# Altium schematic sheet Sensors.SchDoc
size A; SheetNumber: 3; SheetTotal: 3
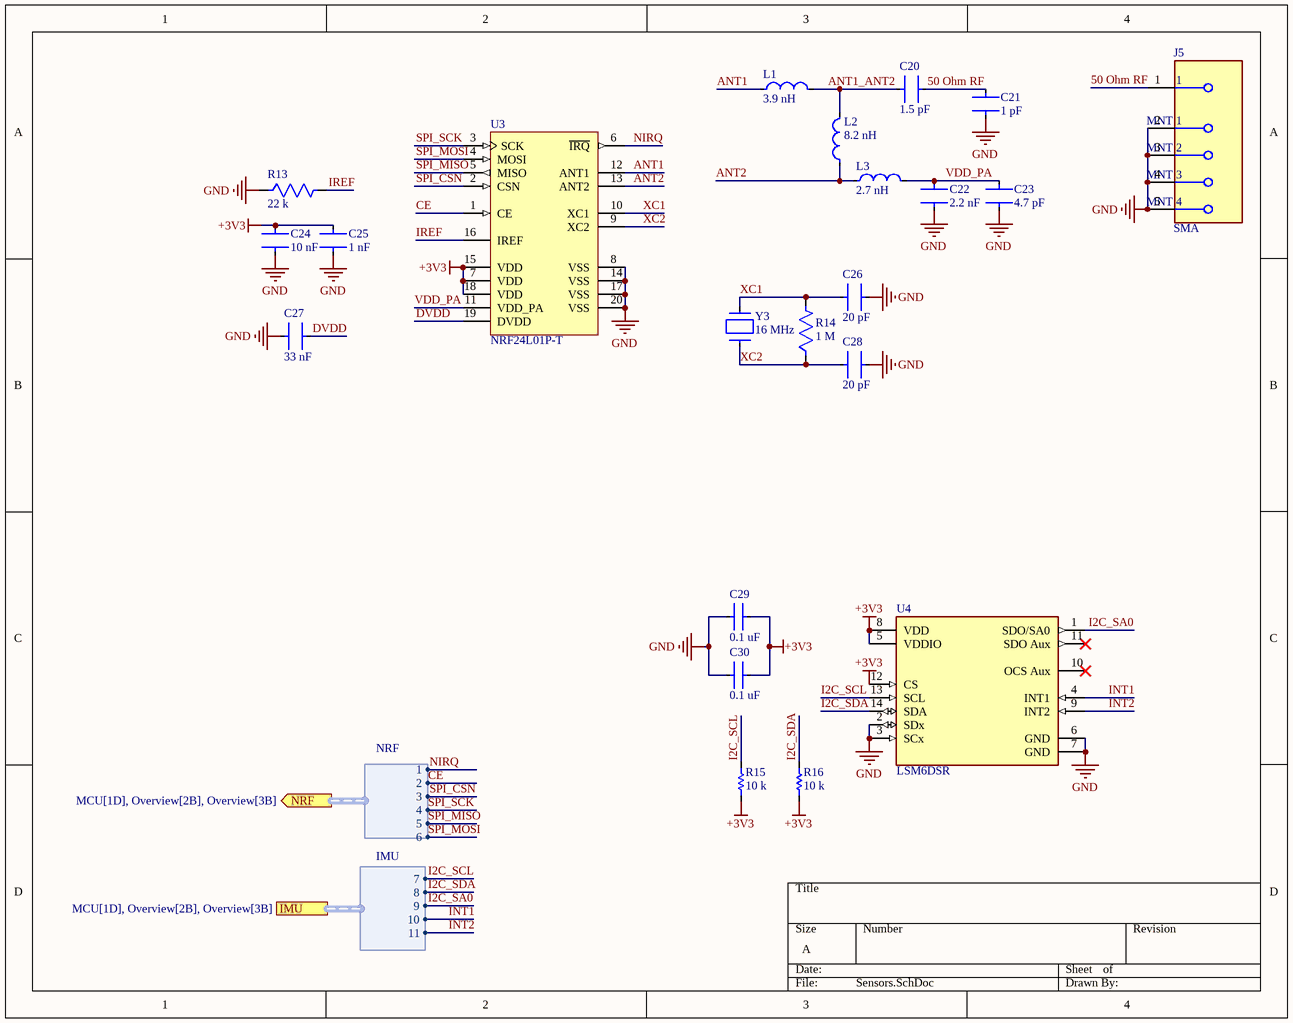
[diagram p0: Sensors.SchDoc]

## Parts
C20  1.5 pF  [1_5pF_0402_Capacitor]
C21  1 pF  [1pF_0402_Capacitor]
C22  2.2 nF  [2_2nF_0402_Capacitor]
C23  4.7 pF  [4_7pF_0402_Capacitor]
C24  10 nF  [10nF_0402_Capacitor]
C25  1 nF  [1nF_0402_Capacitor]
C26  20 pF  [20pF_0402_Capacitor]
C27  33 nF  [33nF_0402_Capacitor]
C28  20 pF  [20pF_0402_Capacitor]
C29  0.1 uF  [0_1uF_0603_Capacitor]
C30  0.1 uF  [0_1uF_0603_Capacitor]
J5  SMA  [SMA_Connector]
L1  3.9 nH  [3_9nH_0402_Inductor]
L2  8.2 nH  [8_2nH_0402_Inductor]
L3  2.7 nH  [2_7nH_0402_Inductor]
R13  22 k  [22k_0402_Resistor]
R14  1 M  [1M_0402_Resistor]
R15  10 k  [10k_0603_Resistor]
R16  10 k  [10k_0603_Resistor]
U3  NRF24L01P-T  [nRF_Transceiver]
U4  LSM6DSR  [IMU]
Y3  16 MHz  [16MHz_Oscillator]

## Ports
IMU (harness IMU, see MCU[1D], Overview[2B], Overview[3B]), NRF (out, harness NRF, see MCU[1D], Overview[2B], Overview[3B])

## Harnesses
NRF: 1, 2, 3, 4, 5, 6
IMU: 7, 8, 9, 10, 11

## Nets
+3V3: C24.1 C25.1 C29.1 C30.1 R15.1 R16.1 U3.7(VDD) U3.15(VDD) U3.18(VDD) U4.5(VDDIO) U4.8(VDD) U4.12(CS)
GND: C21.2 C22.2 C23.2 C24.2 C25.2 C26.1 C27.2 C28.1 C29.2 C30.2 J5.2(MNT_1) J5.3(MNT_2) J5.4(MNT_3) J5.5(MNT_4) R13.1 U3.8(VSS) U3.14(VSS) U3.17(VSS) U3.20(VSS) U4.2(SDx) U4.3(SCx) U4.6(GND) U4.7(GND)
50 Ohm RF: C20.1 C21.1 J5.1
ANT1: L1.1 U3.12(ANT1)
ANT1_ANT2: C20.2 L1.2 L2.2
ANT2: L2.1 L3.1 U3.13(ANT2)
CE: U3.1(CE) ; port NRF.2
DVDD: C27.1 U3.19(DVDD)
I2C_SA0: U4.1(SDO/SA0) ; port IMU.9
I2C_SCL: R15.2 U4.13(SCL) ; port IMU.7
I2C_SDA: R16.2 U4.14(SDA) ; port IMU.8
INT1: U4.4(INT1) ; port IMU.10
INT2: U4.9(INT2) ; port IMU.11
IREF: R13.2 U3.16(IREF)
NIRQ: U3.6(~{IRQ}) ; port NRF.1
SPI_CSN: U3.2(CSN) ; port NRF.3
SPI_MISO: U3.5(MISO) ; port NRF.5
SPI_MOSI: U3.4(MOSI) ; port NRF.6
SPI_SCK: U3.3(SCK) ; port NRF.4
VDD_PA: C22.1 C23.1 L3.2 U3.11(VDD_PA)
XC1: C26.2 R14.2 U3.10(XC1) Y3.2
XC2: C28.2 R14.1 U3.9(XC2) Y3.1

Not connected (* = marked no-connect by the designer): U4 10(OCS_Aux)* 11(SDO_Aux)*

## Library data of the parts
C20 = 1_5pF_0402_Capacitor: Ceramic Capacitor, Multilayer, Ceramic, 50V, 6.67% +Tol, 6.67% -Tol, C0G, 30ppm/Cel TC, 0.0000015uF, Surface Mount, 0402, GJM1555C1H1R5BB01D; Manufacturer: Murata; Value: 1.5pF; Multilayer: Yes; Supplier: Digikey; Supplier Part Number: 490-8087-1-ND; Manufacturer Part Number: GJM1555C1H1R5BB01D; RoHS: Yes; Category: Ceramic Capacitors; Stock: 82715; Pricing: 1=0.14, 10=0.095, 50=0.057, 100=0.0449, 500=0.03314, 1000=0.02744, 2500=0.02554, 5000=0.02336 (USD); Mounting Technology: Surface Mount; Pins: 2; Dielectric Material: Ceramic; Package Shape: Rectangular; Case/Package: 0402; Terminal Finish: Nickel; Min Operating Temperature: -55°C; Max Operating Temperature: 125°C; JESD-609 Code: e3; Capacitor Type: Ceramic; Tolerance  (fill in as +-): 6.67%; Package Style: SMTMeter; Packaging: Tape and Reel; Tolerance (fill in as +-): 6.67%; Rated DC Voltage (URdc): 50V; Temperature Characteristics Code: C0G; Termination: Wraparound; Length: 1mm; Width: 0.5mm; Height: 0.5mm; Reach SVHC Compliant: Yes; RoHS Compliant: Yes; ComponentLink1URL: https://datasheet.ciiva.com:443/pdfs/VipMasterIC/IC/MURE/MURE-S-A0008911298/MURE-S-A0008911391-1.pdf?src-supplier=IHS+Markit; ComponentLink1Description: https://datasheet.ciiva.com:443/pdfs/VipMasterIC/IC/MURE/MURE-S-A0008911298/MURE-S-A0008911391-1.pdf?src-supplier=IHS+Markit; ComponentLink2URL: https://datasheet.ciiva.com/8030/1700191-8030107.pdf?src-supplier=Element14; ComponentLink2Description: https://datasheet.ciiva.com/8030/1700191-8030107.pdf?src-supplier=Element14; ComponentLink3URL: https://datasheet.ciiva.com/26843/getdatasheetpartid-698463-26843693.pdf?src-supplier=Verical; ComponentLink3Description: https://datasheet.ciiva.com/26843/getdatasheetpartid-698463-26843693.pdf?src-supplier=Verical; ComponentLink4URL: https://datasheet.ciiva.com/29542/partnumbering-e-01-29542725.pdf?src-supplier=Digikey; ComponentLink4Description: https://datasheet.ciiva.com/29542/partnumbering-e-01-29542725.pdf?src-supplier=Digikey; ComponentLink5URL: https://datasheet.ciiva.com/29542/partnumbering-e-01-29542726.pdf?src-supplier=Digikey; ComponentLink5Description: https://datasheet.ciiva.com/29542/partnumbering-e-01-29542726.pdf?src-supplier=Digikey; ComponentLink6URL: https://datasheet.ciiva.com/16440/l0005e-16440473.pdf?src-supplier=Future+Electronics; ComponentLink6Description: https://datasheet.ciiva.com/16440/l0005e-16440473.pdf?src-supplier=Future+Electronics; Supplier 1: Digikey; Supplier Part Number 1: 490-8087-1-ND
C21 = 1pF_0402_Capacitor: Ceramic Capacitor, Multilayer, Ceramic, 50V, 5% +Tol, 5% -Tol, C0G, 30ppm/Cel TC, 0.000001uF, Surface Mount, 0402, GJM1555C1H1R0WB01D; Manufacturer: Murata; Value: 1pF; Multilayer: Yes; Supplier: Digikey; Supplier Part Number: 490-11193-1-ND; Manufacturer Part Number: GJM1555C1H1R0WB01D; RoHS: Yes; Category: Ceramic Capacitors; Stock: 48946; Pricing: 1=0.18, 10=0.122, 50=0.073, 100=0.0574, 500=0.04242, 1000=0.03511, 2500=0.03268, 5000=0.0299 (USD); Mounting Technology: Surface Mount; Pins: 2; Dielectric Material: Ceramic; Package Shape: Rectangular; Case/Package: 0402; Terminal Finish: Nickel; Min Operating Temperature: -55°C; Max Operating Temperature: 125°C; JESD-609 Code: e3; Capacitor Type: Ceramic; Tolerance  (fill in as +-): 5%; Package Style: SMTMeter; Packaging: Tape and Reel; Tolerance (fill in as +-): 5%; Rated DC Voltage (URdc): 50V; Temperature Characteristics Code: C0G; Termination: Wraparound; Length: 1mm; Width: 0.5mm; Height: 0.5mm; Reach SVHC Compliant: Yes; RoHS Compliant: Yes; ComponentLink1URL: https://datasheet.ciiva.com:443/pdfs/VipMasterIC/IC/MURE/MURE-S-A0004378008/MURE-S-A0004383032-1.pdf?src-supplier=IHS+Markit; ComponentLink1Description: https://datasheet.ciiva.com:443/pdfs/VipMasterIC/IC/MURE/MURE-S-A0004378008/MURE-S-A0004383032-1.pdf?src-supplier=IHS+Markit; ComponentLink2URL: https://datasheet.ciiva.com/11616/product-11616304.pdf?src-supplier=Avnet; ComponentLink2Description: https://datasheet.ciiva.com/11616/product-11616304.pdf?src-supplier=Avnet; Supplier 1: Digikey; Supplier Part Number 1: 490-11193-1-ND
C22 = 2_2nF_0402_Capacitor: Ceramic Capacitor, Multilayer, Ceramic, 50V, 10% +Tol, 10% -Tol, X7R, 15% TC, 0.0022uF, Surface Mount, 0402, CC0402KRX7R9BB222; Manufacturer: Yageo; Value: 2.2nF; Multilayer: Yes; Supplier: Digikey; Supplier Part Number: 311-1037-1-ND; Manufacturer Part Number: CC0402KRX7R9BB222; RoHS: Yes; Category: Ceramic Capacitors; Stock: 310458; Pricing: 1=0.1, 10=0.017, 50=0.0098, 100=0.0076, 500=0.00572, 1000=0.0045, 2500=0.00409, 5000=0.00376 (USD); Mounting Technology: Surface Mount; Pins: 2; Dielectric Material: Ceramic; Package Shape: Rectangular; Case/Package: 0402; Terminal Finish: Nickel; Min Operating Temperature: -55°C; Max Operating Temperature: 125°C; JESD-609 Code: e3; Capacitor Type: Ceramic; Tolerance  (fill in as +-): 10%; Package Style: SMTMeter; Packaging: Tape and Reel; Tolerance (fill in as +-): 10%; Rated DC Voltage (URdc): 50V; Temperature Characteristics Code: X7R; Termination: Wraparound; Length: 1mm; Width: 0.5mm; Height: 0.5mm; Reach SVHC Compliant: Yes; RoHS Compliant: Yes; ComponentLink1URL: https://datasheet.ciiva.com:443/pdfs/VipMasterIC/IC/YAGO/YAGO-S-A0003557223/YAGO-S-A0003557223-1.pdf?src-supplier=IHS+Markit; ComponentLink1Description: https://datasheet.ciiva.com:443/pdfs/VipMasterIC/IC/YAGO/YAGO-S-A0003557223/YAGO-S-A0003557223-1.pdf?src-supplier=IHS+Markit; ComponentLink2URL: https://datasheet.ciiva.com/26862/getdatasheetpartid-315909-26862649.pdf?src-supplier=Verical; ComponentLink2Description: https://datasheet.ciiva.com/26862/getdatasheetpartid-315909-26862649.pdf?src-supplier=Verical; ComponentLink3URL: https://datasheet.ciiva.com/155/mlccorderingcode-155866.pdf?src-supplier=Digikey; ComponentLink3Description: https://datasheet.ciiva.com/155/mlccorderingcode-155866.pdf?src-supplier=Digikey; ComponentLink4URL: https://datasheet.ciiva.com/155/mlccorderingcode-155867.pdf?src-supplier=Digikey; ComponentLink4Description: https://datasheet.ciiva.com/155/mlccorderingcode-155867.pdf?src-supplier=Digikey; ComponentLink5URL: https://datasheet.ciiva.com/155/mlccorderingcode-155868.pdf?src-supplier=Digikey; ComponentLink5Description: https://datasheet.ciiva.com/155/mlccorderingcode-155868.pdf?src-supplier=Digikey; ComponentLink6URL: https://datasheet.ciiva.com/11464/upy-gphc-x7r-6-3v-to-50v-8-11464903.pdf?src-supplier=Avnet; ComponentLink6Description: https://datasheet.ciiva.com/11464/upy-gphc-x7r-6-3v-to-50v-8-11464903.pdf?src-supplier=Avnet; ComponentLink7URL: https://datasheet.ciiva.com/8033/1489800-8033625.pdf?src-supplier=Element14; ComponentLink7Description: https://datasheet.ciiva.com/8033/1489800-8033625.pdf?src-supplier=Element14; ComponentLink8URL: https://datasheet.ciiva.com/8033/70765-8033626.pdf?src-supplier=Element14; ComponentLink8Description: https://datasheet.ciiva.com/8033/70765-8033626.pdf?src-supplier=Element14; ComponentLink9URL: https://datasheet.ciiva.com/8033/1489800-8033627.pdf?src-supplier=Element14; ComponentLink9Description: https://datasheet.ciiva.com/8033/1489800-8033627.pdf?src-supplier=Element14; Supplier 1: Digikey; Supplier Part Number 1: 311-1037-1-ND
C23 = 4_7pF_0402_Capacitor: Ceramic Capacitor, Multilayer, Ceramic, 50V, 5.32% +Tol, 5.32% -Tol, C0G, 30ppm/Cel TC, 0.0000047uF, Surface Mount, 0402, GJM1555C1H4R7CB01D; Manufacturer: Murata; Value: 4.7pF; Multilayer: Yes; Supplier: Digikey; Supplier Part Number: 490-3100-1-ND; Manufacturer Part Number: GJM1555C1H4R7CB01D; RoHS: Yes; Category: Ceramic Capacitors; Stock: 754324; Pricing: 1=0.1, 10=0.047, 50=0.0268, 100=0.0208, 500=0.01566, 1000=0.0123, 2500=0.01118, 5000=0.01029 (USD); Mounting Technology: Surface Mount; Pins: 2; Dielectric Material: Ceramic; Package Shape: Rectangular; Case/Package: 0402; Terminal Finish: Nickel; Min Operating Temperature: -55°C; Max Operating Temperature: 125°C; JESD-609 Code: e3; Capacitor Type: Ceramic; Tolerance  (fill in as +-): 5.32%; Package Style: SMTMeter; Packaging: Tape and Reel; Tolerance (fill in as +-): 5.32%; Rated DC Voltage (URdc): 50V; Temperature Characteristics Code: C0G; Termination: Wraparound; Length: 1mm; Width: 0.5mm; Height: 0.5mm; Reach SVHC Compliant: Yes; RoHS Compliant: Yes; ComponentLink1URL: https://datasheet.ciiva.com:443/pdfs/VipMasterIC/IC/MURE/MURE-S-A0008911298/MURE-S-A0008911422-1.pdf?src-supplier=IHS+Markit; ComponentLink1Description: https://datasheet.ciiva.com:443/pdfs/VipMasterIC/IC/MURE/MURE-S-A0008911298/MURE-S-A0008911422-1.pdf?src-supplier=IHS+Markit; ComponentLink2URL: https://datasheet.ciiva.com/11789/0900766b80ef921d-11789169.pdf?src-supplier=Rs; ComponentLink2Description: https://datasheet.ciiva.com/11789/0900766b80ef921d-11789169.pdf?src-supplier=Rs; ComponentLink3URL: https://datasheet.ciiva.com/11613/product-11613025.pdf?src-supplier=Avnet; ComponentLink3Description: https://datasheet.ciiva.com/11613/product-11613025.pdf?src-supplier=Avnet; ComponentLink4URL: https://datasheet.ciiva.com/18183/getdatasheetpartid-178941-18183849.pdf?src-supplier=Verical; ComponentLink4Description: https://datasheet.ciiva.com/18183/getdatasheetpartid-178941-18183849.pdf?src-supplier=Verical; ComponentLink5URL: https://datasheet.ciiva.com/8030/1700177-8030123.pdf?src-supplier=Element14; ComponentLink5Description: https://datasheet.ciiva.com/8030/1700177-8030123.pdf?src-supplier=Element14; ComponentLink6URL: https://datasheet.ciiva.com/5694/1700177-5694989.pdf?src-supplier=Farnell; ComponentLink6Description: https://datasheet.ciiva.com/5694/1700177-5694989.pdf?src-supplier=Farnell; ComponentLink7URL: https://datasheet.ciiva.com/133/partnumbering-e-01-133147.pdf?src-supplier=Digikey; ComponentLink7Description: https://datasheet.ciiva.com/133/partnumbering-e-01-133147.pdf?src-supplier=Digikey; ComponentLink8URL: https://datasheet.ciiva.com/133/partnumbering-e-01-133148.pdf?src-supplier=Digikey; ComponentLink8Description: https://datasheet.ciiva.com/133/partnumbering-e-01-133148.pdf?src-supplier=Digikey; ComponentLink9URL: https://datasheet.ciiva.com/133/partnumbering-e-01-133149.pdf?src-supplier=Digikey; ComponentLink9Description: https://datasheet.ciiva.com/133/partnumbering-e-01-133149.pdf?src-supplier=Digikey; ComponentLink10URL: https://datasheet.ciiva.com/16440/l0005e-16440462.pdf?src-supplier=Future+Electronics; ComponentLink10Description: https://datasheet.ciiva.com/16440/l0005e-16440462.pdf?src-supplier=Future+Electronics; Supplier 1: Digikey; Supplier Part Number 1: 490-3100-1-ND
C24 = 10nF_0402_Capacitor: Ceramic Capacitor, Multilayer, Ceramic, 16V, 10% +Tol, 10% -Tol, X7R, 15% TC, 0.01uF, Surface Mount, 0402, CC0402KRX7R7BB103; Manufacturer: Yageo; Value: 10nF; Multilayer: Yes; Supplier: Digikey; Supplier Part Number: 311-1042-1-ND; Manufacturer Part Number: CC0402KRX7R7BB103; RoHS: Yes; Category: Ceramic Capacitors; Stock: 1013311; Pricing: 1=0.1, 10=0.015, 50=0.0088, 100=0.0068, 500=0.0051, 1000=0.004, 2500=0.00364, 5000=0.00335 (USD); Mounting Technology: Surface Mount; Pins: 2; Dielectric Material: Ceramic; Package Shape: Rectangular; Case/Package: 0402; Terminal Finish: Nickel; Min Operating Temperature: -55°C; Max Operating Temperature: 125°C; JESD-609 Code: e3; Capacitor Type: Ceramic; Tolerance  (fill in as +-): 10%; Package Style: SMTMeter; Packaging: Tape and Reel; Tolerance (fill in as +-): 10%; Rated DC Voltage (URdc): 16V; Temperature Characteristics Code: X7R; Termination: Wraparound; Length: 1mm; Width: 0.5mm; Height: 0.5mm; Reach SVHC Compliant: Yes; RoHS Compliant: Yes; ComponentLink1URL: https://datasheet.ciiva.com:443/pdfs/VipMasterIC/IC/YAGO/YAGO-S-A0003557223/YAGO-S-A0003557223-1.pdf?src-supplier=IHS+Markit; ComponentLink1Description: https://datasheet.ciiva.com:443/pdfs/VipMasterIC/IC/YAGO/YAGO-S-A0003557223/YAGO-S-A0003557223-1.pdf?src-supplier=IHS+Markit; ComponentLink2URL: https://datasheet.ciiva.com/143/mlccorderingcode-143950.pdf?src-supplier=Digikey; ComponentLink2Description: https://datasheet.ciiva.com/143/mlccorderingcode-143950.pdf?src-supplier=Digikey; ComponentLink3URL: https://datasheet.ciiva.com/143/mlccorderingcode-143951.pdf?src-supplier=Digikey; ComponentLink3Description: https://datasheet.ciiva.com/143/mlccorderingcode-143951.pdf?src-supplier=Digikey; ComponentLink4URL: https://datasheet.ciiva.com/143/upy-gphc-x7r-6-3v-to-50v-8-143952.pdf?src-supplier=Digikey; ComponentLink4Description: https://datasheet.ciiva.com/143/upy-gphc-x7r-6-3v-to-50v-8-143952.pdf?src-supplier=Digikey; ComponentLink5URL: https://datasheet.ciiva.com/28450/1489800-28450330.pdf?src-supplier=Element14; ComponentLink5Description: https://datasheet.ciiva.com/28450/1489800-28450330.pdf?src-supplier=Element14; ComponentLink6URL: https://datasheet.ciiva.com/8033/70765-8033655.pdf?src-supplier=Element14; ComponentLink6Description: https://datasheet.ciiva.com/8033/70765-8033655.pdf?src-supplier=Element14; ComponentLink7URL: https://datasheet.ciiva.com/8033/1489800-8033658.pdf?src-supplier=Element14; ComponentLink7Description: https://datasheet.ciiva.com/8033/1489800-8033658.pdf?src-supplier=Element14; ComponentLink8URL: https://datasheet.ciiva.com/8033/1489800-8033659.pdf?src-supplier=Element14; ComponentLink8Description: https://datasheet.ciiva.com/8033/1489800-8033659.pdf?src-supplier=Element14; ComponentLink9URL: https://datasheet.ciiva.com/5425/upy-gp-np0-16v-to-50v-8-3714-5425438.pdf?src-supplier=Mouser; ComponentLink9Description: https://datasheet.ciiva.com/5425/upy-gp-np0-16v-to-50v-8-3714-5425438.pdf?src-supplier=Mouser; ComponentLink10URL: https://datasheet.ciiva.com/7978/1489800-7978109.pdf?src-supplier=Element14; ComponentLink10Description: https://datasheet.ciiva.com/7978/1489800-7978109.pdf?src-supplier=Element14; Supplier 1: Digikey; Supplier Part Number 1: 311-1042-1-ND
C25 = 1nF_0402_Capacitor: Ceramic Capacitor, Multilayer, Ceramic, 50V, 5% +Tol, 5% -Tol, C0G, 30ppm/Cel TC, 0.001uF, Surface Mount, 0402, GRM1555C1H102JA01D; Manufacturer: Murata; Value: 1nF; Multilayer: Yes; Supplier: Digikey; Supplier Part Number: 490-3244-1-ND; Manufacturer Part Number: GRM1555C1H102JA01D; RoHS: Yes; Category: Ceramic Capacitors; Stock: 19426344; Pricing: 1=0.1, 10=0.025, 50=0.0146, 100=0.0113, 500=0.00848, 1000=0.00666, 2500=0.00605, 5000=0.00557 (USD); Mounting Technology: Surface Mount; Pins: 2; Dielectric Material: Ceramic; Package Shape: Rectangular; Case/Package: 0402; Terminal Finish: Nickel; Min Operating Temperature: -55°C; Max Operating Temperature: 125°C; Capacitor Type: Ceramic; JESD-609 Code: e3; Tolerance  (fill in as +-): 5%; Package Style: SMTMeter; Packaging: Tape and Reel; Tolerance (fill in as +-): 5%; Rated DC Voltage (URdc): 50V; Temperature Characteristics Code: C0G; Termination: Wraparound; Length: 1mm; Width: 0.5mm; Height: 0.5mm; Reach SVHC Compliant: Yes; RoHS Compliant: Yes; ComponentLink1URL: https://psearch.en.murata.com:443/capacitor/product/GRM1555C1H102JA01%23.pdf?src-supplier=IHS+Markit; ComponentLink1Description: https://psearch.en.murata.com:443/capacitor/product/GRM1555C1H102JA01%23.pdf?src-supplier=IHS+Markit; ComponentLink2URL: https://datasheet.ciiva.com/11786/0900766b807a1cab-11786727.pdf?src-supplier=Rs; ComponentLink2Description: https://datasheet.ciiva.com/11786/0900766b807a1cab-11786727.pdf?src-supplier=Rs; ComponentLink3URL: https://datasheet.ciiva.com/132/grm1555c1h102ja01-01-132799.pdf?src-supplier=Digikey; ComponentLink3Description: https://datasheet.ciiva.com/132/grm1555c1h102ja01-01-132799.pdf?src-supplier=Digikey; ComponentLink4URL: https://datasheet.ciiva.com/132/product-132800.pdf?src-supplier=Digikey; ComponentLink4Description: https://datasheet.ciiva.com/132/product-132800.pdf?src-supplier=Digikey; ComponentLink5URL: https://datasheet.ciiva.com/18184/getdatasheetpartid-90260-18184180.pdf?src-supplier=Verical; ComponentLink5Description: https://datasheet.ciiva.com/18184/getdatasheetpartid-90260-18184180.pdf?src-supplier=Verical; ComponentLink6URL: https://datasheet.ciiva.com/34302/1855908-34302849.pdf?src-supplier=Jameco; ComponentLink6Description: https://datasheet.ciiva.com/34302/1855908-34302849.pdf?src-supplier=Jameco; ComponentLink7URL: https://datasheet.ciiva.com/29200/453569-da-01-en-vs-kondensator-0402-29200121.pdf?src-supplier=Conrad; ComponentLink7Description: https://datasheet.ciiva.com/29200/453569-da-01-en-vs-kondensator-0402-29200121.pdf?src-supplier=Conrad; ComponentLink8URL: https://datasheet.ciiva.com/14116/grmseries-tc-hitype-eng-14116858.pdf?src-supplier=Distrelec; ComponentLink8Description: https://datasheet.ciiva.com/14116/grmseries-tc-hitype-eng-14116858.pdf?src-supplier=Distrelec; ComponentLink9URL: https://datasheet.ciiva.com/14116/grmseries-tc-hitype-eng-14116919.pdf?src-supplier=Distrelec; ComponentLink9Description: https://datasheet.ciiva.com/14116/grmseries-tc-hitype-eng-14116919.pdf?src-supplier=Distrelec; ComponentLink10URL: https://datasheet.ciiva.com/7828/4360-7828821.pdf?src-supplier=Element14; ComponentLink10Description: https://datasheet.ciiva.com/7828/4360-7828821.pdf?src-supplier=Element14; ComponentLink11URL: https://datasheet.ciiva.com/7828/1747436-7828822.pdf?src-supplier=Element14; ComponentLink11Description: https://datasheet.ciiva.com/7828/1747436-7828822.pdf?src-supplier=Element14; ComponentLink12URL: https://datasheet.ciiva.com/132/grm1555c1h102ja01-01-132801.pdf?src-supplier=Digikey; ComponentLink12Description: https://datasheet.ciiva.com/132/grm1555c1h102ja01-01-132801.pdf?src-supplier=Digikey; Supplier 1: Digikey; Supplier Part Number 1: 490-3244-1-ND
C26 C28 = 20pF_0402_Capacitor: Ceramic Capacitor, Multilayer, Ceramic, 50V, 5% +Tol, 5% -Tol, C0G, 30% TC, 0.00002uF, Surface Mount, 0402, GJM1555C1H200JB01D; Manufacturer: Murata; Value: 20pF; Multilayer: Yes; Supplier: Digikey; Supplier Part Number: 490-3120-1-ND; Manufacturer Part Number: GJM1555C1H200JB01D; RoHS: Yes; Category: Ceramic Capacitors; Stock: 56145; Pricing: 1=0.17, 10=0.116, 50=0.0694, 100=0.0546, 500=0.0403, 1000=0.03337, 2500=0.03106, 5000=0.02841 (USD); Mounting Technology: Surface Mount; Pins: 2; Dielectric Material: Ceramic; Package Shape: Rectangular; Case/Package: 0402; Terminal Finish: Nickel; Min Operating Temperature: -55°C; Max Operating Temperature: 125°C; JESD-609 Code: e3; Capacitor Type: Ceramic; Tolerance  (fill in as +-): 5%; Package Style: SMTMeter; Packaging: Tape and Reel; Tolerance (fill in as +-): 5%; Rated DC Voltage (URdc): 50V; Temperature Characteristics Code: C0G; Termination: Wraparound; Length: 1mm; Width: 0.5mm; Height: 0.5mm; Reach SVHC Compliant: Yes; RoHS Compliant: Yes; ComponentLink1URL: https://datasheet.ciiva.com:443/pdfs/VipMasterIC/IC/MURE/MURE-S-A0004383799/MURE-S-A0004383921-1.pdf?src-supplier=IHS+Markit; ComponentLink1Description: https://datasheet.ciiva.com:443/pdfs/VipMasterIC/IC/MURE/MURE-S-A0004383799/MURE-S-A0004383921-1.pdf?src-supplier=IHS+Markit; ComponentLink2URL: https://datasheet.ciiva.com/165/product-165055.pdf?src-supplier=Digikey; ComponentLink2Description: https://datasheet.ciiva.com/165/product-165055.pdf?src-supplier=Digikey; ComponentLink3URL: https://datasheet.ciiva.com/29540/partnumbering-e-01-29540584.pdf?src-supplier=Digikey; ComponentLink3Description: https://datasheet.ciiva.com/29540/partnumbering-e-01-29540584.pdf?src-supplier=Digikey; ComponentLink4URL: https://datasheet.ciiva.com/29540/partnumbering-e-01-29540583.pdf?src-supplier=Digikey; ComponentLink4Description: https://datasheet.ciiva.com/29540/partnumbering-e-01-29540583.pdf?src-supplier=Digikey; Supplier 1: Digikey; Supplier Part Number 1: 490-3120-1-ND
C27 = 33nF_0402_Capacitor: Ceramic Capacitor, Multilayer, Ceramic, 25V, 10% +Tol, 10% -Tol, X7R, 15% TC, 0.033uF, Surface Mount, 0402, GRM155R71E333KA88D; Manufacturer: Murata; Value: 33nF; Multilayer: Yes; Supplier: Digikey; Supplier Part Number: 490-3253-1-ND; Manufacturer Part Number: GRM155R71E333KA88D; RoHS: Yes; Category: Ceramic Capacitors; Stock: 395671; Pricing: 1=0.1, 10=0.059, 50=0.034, 100=0.0263, 500=0.01982, 1000=0.01558, 2500=0.01416, 5000=0.01303 (USD); Mounting Technology: Surface Mount; Pins: 2; Dielectric Material: Ceramic; Package Shape: Rectangular; Case/Package: 0402; Terminal Finish: Nickel; Min Operating Temperature: -55°C; Max Operating Temperature: 125°C; Capacitor Type: Ceramic; JESD-609 Code: e3; Tolerance  (fill in as +-): 10%; Package Style: SMTMeter; Packaging: Tape and Reel; Tolerance (fill in as +-): 10%; Rated DC Voltage (URdc): 25V; Temperature Characteristics Code: X7R; Termination: Wraparound; Length: 1mm; Width: 0.5mm; Height: 0.5mm; Reach SVHC Compliant: Yes; RoHS Compliant: Yes; ComponentLink1URL: https://datasheet.ciiva.com:443/pdfs/VipMasterIC/IC/MURE/MURE-S-A0004362469/MURE-S-A0004364704-1.pdf?src-supplier=IHS+Markit; ComponentLink1Description: https://datasheet.ciiva.com:443/pdfs/VipMasterIC/IC/MURE/MURE-S-A0004362469/MURE-S-A0004364704-1.pdf?src-supplier=IHS+Markit; ComponentLink2URL: https://datasheet.ciiva.com/131/product-131792.pdf?src-supplier=Digikey; ComponentLink2Description: https://datasheet.ciiva.com/131/product-131792.pdf?src-supplier=Digikey; ComponentLink3URL: https://datasheet.ciiva.com/18184/getdatasheetpartid-153135-18184704.pdf?src-supplier=Verical; ComponentLink3Description: https://datasheet.ciiva.com/18184/getdatasheetpartid-153135-18184704.pdf?src-supplier=Verical; ComponentLink4URL: https://datasheet.ciiva.com/7937/608985-7937622.pdf?src-supplier=Element14; ComponentLink4Description: https://datasheet.ciiva.com/7937/608985-7937622.pdf?src-supplier=Element14; ComponentLink5URL: https://datasheet.ciiva.com/131/grm155r71e333ka88-01-131793.pdf?src-supplier=Digikey; ComponentLink5Description: https://datasheet.ciiva.com/131/grm155r71e333ka88-01-131793.pdf?src-supplier=Digikey; ComponentLink6URL: https://datasheet.ciiva.com/131/grm155r71e333ka88-01-131794.pdf?src-supplier=Digikey; ComponentLink6Description: https://datasheet.ciiva.com/131/grm155r71e333ka88-01-131794.pdf?src-supplier=Digikey; ComponentLink7URL: https://datasheet.ciiva.com/2989/product-2989391.pdf?src-supplier=Avnet; ComponentLink7Description: https://datasheet.ciiva.com/2989/product-2989391.pdf?src-supplier=Avnet; ComponentLink8URL: https://datasheet.ciiva.com/2989/product-2989392.pdf?src-supplier=Avnet; ComponentLink8Description: https://datasheet.ciiva.com/2989/product-2989392.pdf?src-supplier=Avnet; ComponentLink9URL: https://datasheet.ciiva.com/14103/grmseries-highdielectrictype-eng-14103753.pdf?src-supplier=Distrelec; ComponentLink9Description: https://datasheet.ciiva.com/14103/grmseries-highdielectrictype-eng-14103753.pdf?src-supplier=Distrelec; ComponentLink10URL: https://datasheet.ciiva.com/16208/product-16208394.pdf?src-supplier=Future+Electronics; ComponentLink10Description: https://datasheet.ciiva.com/16208/product-16208394.pdf?src-supplier=Future+Electronics; Supplier 1: Digikey; Supplier Part Number 1: 490-3253-1-ND
C29 C30 = 0_1uF_0603_Capacitor: Ceramic Capacitor, Multilayer, Ceramic, 50V, 10% +Tol, 10% -Tol, X8L, -40/+15% TC, 0.1uF, Surface Mount, 0603, GCM188L81H104KA57D; Manufacturer: Murata; Value: 100nF; Multilayer: Yes; Reference Standard: AEC-Q200; Supplier: Digikey; Supplier Part Number: 490-6049-1-ND; Manufacturer Part Number: GCM188L81H104KA57D; RoHS: Yes; Category: Ceramic Capacitors; Stock: 1946064; Pricing: 1=0.13, 10=0.087, 50=0.0522, 100=0.0411, 500=0.03032, 1000=0.0251 (USD); Mounting Technology: Surface Mount; Pins: 2; Dielectric Material: Ceramic; Package Shape: Rectangular; Case/Package: 0603; Terminal Finish: Nickel; Min Operating Temperature: -55°C; Max Operating Temperature: 150°C; JESD-609 Code: e3; Capacitor Type: Ceramic; Tolerance  (fill in as +-): 10%; Packaging: Tape and Reel; Tolerance (fill in as +-): 10%; Rated DC Voltage (URdc): 50V; Temperature Characteristics Code: X8L; Termination: Wraparound; Reach SVHC Compliant: Yes; RoHS Compliant: Yes; ComponentLink1URL: https://datasheet.ciiva.com:443/pdfs/VipMasterIC/IC/MURE/MURE-S-A0004370842/MURE-S-A0004371512-1.pdf?src-supplier=IHS+Markit; ComponentLink1Description: https://datasheet.ciiva.com:443/pdfs/VipMasterIC/IC/MURE/MURE-S-A0004370842/MURE-S-A0004371512-1.pdf?src-supplier=IHS+Markit; Supplier 1: Digikey; Supplier Part Number 1: 490-6049-1-ND
J5 = SMA_Connector: RF SMA Connector, 1 Contact(s), Female, Panel Mount, Board Mount, Surface Mount Terminal, Locking, Jack, 73251-1350 Molex; Manufacturer Series: 73251; Characteristic Impedance: 50R; Contact Style: Coax; Operating Frequency-Max: 18kHz; Panel Mount: Yes; Dielectric Withstanding Voltage (AC): 1.4kV; Durability: 500Cycles; Insertion Loss: 0.17dB; Number of Ports: 1; VSWR: 1.07; Insulation Resistance: 5GR; Contact Resistance: 3mR; Body Depth: 0.375inch; Reliability: COMMERCIAL; Supplier: Digikey; Supplier Part Number: WM9458-ND; Manufacturer: Molex; Manufacturer Part Number: 73251-1350; RoHS: Yes; Category: RF / Coaxial Connectors; Stock: 2853; Pricing: 1=5.07, 10=4.458, 100=3.546, 1000=2.93808, 2500=2.73545 (USD); Mounting Technology: Board; Insulation Material: Teflon; Contact Finish - Mating: NOT SPECIFIED; Shell Finish: Gold; Shell Material: Brass; Min Operating Temperature: -65°C; Max Operating Temperature: 165°C; Connector Type: SMA; Body/Shell Style: JACK; Contact Gender: Female; Mounting Style: STRAIGHT; Termination: SMD/SMT; Number of Contacts: 1; Mounting Option 1: LOCKING; RoHS Compliant: Yes; Reach SVHC Compliant: No; ComponentLink1URL: https://datasheet.ciiva.com:443/pdfs/VipMasterIC/IC/MOLE/MOLE-S-A0001396055/MOLE-S-A0001473074-1.pdf?src-supplier=IHS+Markit; ComponentLink1Description: https://datasheet.ciiva.com:443/pdfs/VipMasterIC/IC/MOLE/MOLE-S-A0001396055/MOLE-S-A0001473074-1.pdf?src-supplier=IHS+Markit; Supplier 1: Digikey; Supplier Part Number 1: WM9458-ND
L1 = 3_9nH_0402_Inductor: General Purpose Inductor, 0.0039uH, 2.564%, 1 Element, SMD, 0402, LQW15AN3N9B80D; Manufacturer: Murata; DC Resistance (DCR): 30mR; Inductor Application: RF INDUCTOR; Channels: 1; Quality Factor-Min (at L-nom): 35; Max Current Rating: 1.95A; Self Resonant Frequency: 10GHz; Shape/Size Description: RECTANGULAR PACKAGE; Shielding: Unshielded; Test Frequency: 100MHz; Supplier: Digikey; Supplier Part Number: 490-16884-1-ND; Manufacturer Part Number: LQW15AN3N9B80D; RoHS: Yes; Category: Fixed Inductors; Stock: 21269; Pricing: 1=0.22, 10=0.183, 25=0.168, 50=0.1484, 100=0.1298, 250=0.1236, 500=0.11618, 1000=0.08899, 2500=0.08405 (USD); Pins: 2; Terminal Finish: Tin; Min Operating Temperature: -55°C; Max Operating Temperature: 125°C; Tolerance: 2.564%; JESD-609 Code: e3; Inductance-Nom (L): 0.0039uH; Inductor Type: GENERAL PURPOSE INDUCTOR; Surface Mount: Yes; Terminal Placement: Dual Ended; Termination: One Surface; Reach SVHC Compliant: Yes; RoHS Compliant: Yes; ComponentLink1URL: https://datasheet.ciiva.com:443/pdfs/VipMasterIC/IC/MURE/MURE-S-A0004390746/MURE-S-A0004390825-1.pdf?src-supplier=IHS+Markit; ComponentLink1Description: https://datasheet.ciiva.com:443/pdfs/VipMasterIC/IC/MURE/MURE-S-A0004390746/MURE-S-A0004390825-1.pdf?src-supplier=IHS+Markit; ComponentLink2URL: https://datasheet.ciiva.com/29692/l0075e-29692360.pdf?src-supplier=Digikey; ComponentLink2Description: https://datasheet.ciiva.com/29692/l0075e-29692360.pdf?src-supplier=Digikey; Supplier 1: Digikey; Supplier Part Number 1: 490-16884-1-ND
L2 = 8_2nH_0402_Inductor: General Purpose Inductor, 0.0082uH, 2%, 1 Element, Alumina-Core, SMD, 0402, LQW15AN8N2G00D; Manufacturer: Murata; Case/Size Code: 0402; DC Resistance (DCR): 140mR; Inductor Application: RF INDUCTOR; Channels: 1; Quality Factor-Min (at L-nom): 25; Max Current Rating: 540mA; Self Resonant Frequency: 5.5GHz; Shape/Size Description: RECTANGULAR PACKAGE; Shielding: Unshielded; Test Frequency: 100MHz; Package Height: 0.5mm; Package Length: 1mm; Package Width: 0.6mm; Supplier: Digikey; Supplier Part Number: 490-6849-1-ND; Manufacturer Part Number: LQW15AN8N2G00D; RoHS: Yes; Category: Fixed Inductors; Stock: 61912; Pricing: 1=0.15, 10=0.126, 25=0.1156, 50=0.102, 100=0.0892, 250=0.08496, 500=0.07988, 1000=0.06118, 2500=0.05778 (USD); Pins: 2; Core Material: Alumina; Terminal Finish: Nickel; Min Operating Temperature: -55°C; Max Operating Temperature: 125°C; Tolerance: 2%; JESD-609 Code: e3; Construction: Wirewound Chip; Inductance-Nom (L): 0.0082uH; Inductor Type: GENERAL PURPOSE INDUCTOR; Package Style: SMTMeter; Packaging: Tape and Reel; Surface Mount: Yes; Terminal Placement: Dual Ended; Termination: One Surface; Reach SVHC Compliant: Yes; RoHS Compliant: Yes; ComponentLink1URL: https://datasheet.ciiva.com:443/pdfs/VipMasterIC/IC/MURE/MURE-S-A0004390706/MURE-S-A0004390637-1.pdf?src-supplier=IHS+Markit; ComponentLink1Description: https://datasheet.ciiva.com:443/pdfs/VipMasterIC/IC/MURE/MURE-S-A0004390706/MURE-S-A0004390637-1.pdf?src-supplier=IHS+Markit; ComponentLink2URL: https://datasheet.ciiva.com/11799/0900766b8090d800-11799384.pdf?src-supplier=Rs; ComponentLink2Description: https://datasheet.ciiva.com/11799/0900766b8090d800-11799384.pdf?src-supplier=Rs; ComponentLink3URL: https://datasheet.ciiva.com/16455/l0075s0080lqw15a-00-16455832.pdf?src-supplier=Future+Electronics; ComponentLink3Description: https://datasheet.ciiva.com/16455/l0075s0080lqw15a-00-16455832.pdf?src-supplier=Future+Electronics; Supplier 1: Digikey; Supplier Part Number 1: 490-6849-1-ND
L3 = 2_7nH_0402_Inductor: General Purpose Inductor, 0.0027uH, 18.519%, 1 Element, Alumina-Core, SMD, 0402, LQW15AN2N7D00D; Manufacturer: Murata; Case/Size Code: 0402; DC Resistance (DCR): 50mR; Inductor Application: RF INDUCTOR; Channels: 1; Quality Factor-Min (at L-nom): 20; Max Current Rating: 850mA; Self Resonant Frequency: 15GHz; Shape/Size Description: RECTANGULAR PACKAGE; Shielding: Unshielded; Test Frequency: 100MHz; Package Height: 0.5mm; Package Length: 1mm; Package Width: 0.6mm; Supplier: Digikey; Supplier Part Number: 490-1137-1-ND; Manufacturer Part Number: LQW15AN2N7D00D; RoHS: Yes; Category: Fixed Inductors; Stock: 37602; Pricing: 1=0.14, 10=0.114, 25=0.1052, 50=0.0928, 100=0.0811, 250=0.07724, 500=0.07262, 1000=0.05562, 2500=0.05253 (USD); Pins: 2; Core Material: Alumina; Terminal Finish: Nickel; Min Operating Temperature: -55°C; Max Operating Temperature: 125°C; Tolerance: 18.519%; JESD-609 Code: e3; Construction: Wirewound Chip; Inductance-Nom (L): 0.0027uH; Inductor Type: GENERAL PURPOSE INDUCTOR; Package Style: SMTMeter; Packaging: Tape and Reel; Surface Mount: Yes; Terminal Placement: Dual Ended; Termination: One Surface; Reach SVHC Compliant: Yes; RoHS Compliant: Yes; ComponentLink1URL: https://datasheet.ciiva.com:443/pdfs/VipMasterIC/IC/MURE/MURE-S-A0004391032/MURE-S-A0004391027-1.pdf?src-supplier=IHS+Markit; ComponentLink1Description: https://datasheet.ciiva.com:443/pdfs/VipMasterIC/IC/MURE/MURE-S-A0004391032/MURE-S-A0004391027-1.pdf?src-supplier=IHS+Markit; ComponentLink2URL: https://datasheet.ciiva.com/11799/0900766b8090d5c4-11799044.pdf?src-supplier=Rs; ComponentLink2Description: https://datasheet.ciiva.com/11799/0900766b8090d5c4-11799044.pdf?src-supplier=Rs; ComponentLink3URL: https://datasheet.ciiva.com/8510/l0075s0080lqw15a-00-8510431.pdf?src-supplier=Avnet; ComponentLink3Description: https://datasheet.ciiva.com/8510/l0075s0080lqw15a-00-8510431.pdf?src-supplier=Avnet; ComponentLink4URL: https://datasheet.ciiva.com/1042/l0075s0080lqw15a-00-1042210.pdf?src-supplier=Digikey; ComponentLink4Description: https://datasheet.ciiva.com/1042/l0075s0080lqw15a-00-1042210.pdf?src-supplier=Digikey; ComponentLink5URL: https://datasheet.ciiva.com/1042/l0075s0080lqw15a-00-1042211.pdf?src-supplier=Digikey; ComponentLink5Description: https://datasheet.ciiva.com/1042/l0075s0080lqw15a-00-1042211.pdf?src-supplier=Digikey; ComponentLink6URL: https://datasheet.ciiva.com/1042/l0075s0080lqw15a-00-1042212.pdf?src-supplier=Digikey; ComponentLink6Description: https://datasheet.ciiva.com/1042/l0075s0080lqw15a-00-1042212.pdf?src-supplier=Digikey; ComponentLink7URL: https://datasheet.ciiva.com/4977/product-4977324.pdf?src-supplier=Mouser; ComponentLink7Description: https://datasheet.ciiva.com/4977/product-4977324.pdf?src-supplier=Mouser; Supplier 1: Digikey; Supplier Part Number 1: 490-1137-1-ND
R13 = 22k_0402_Resistor: Fixed Resistor, Metal Glaze/thick Film, 0.063W, 22000ohm, 50V, 5% +/-Tol, 200ppm/Cel, Surface Mount, 0402, CRCW040222K0JNED; Manufacturer: Vishay Dale; Power: 63mW; Rated Temperature: 70°C; Value: 22kR; Temperature Coefficient: 200ppm/°C; Package Height: 0.35mm; Package Length: 1mm; Package Width: 0.5mm; Reference Standard: AEC-Q200; Supplier: Digikey; Supplier Part Number: 541-22KJCT-ND; Manufacturer Part Number: CRCW040222K0JNED; RoHS: Yes; Category: Chip SMD Resistors; Stock: 10421; Pricing: 1=0.1, 10=0.024, 50=0.0152, 100=0.0127, 500=0.00866, 1000=0.00746, 5000=0.00542 (USD); Mounting Technology: Surface Mount; Pins: 2; Package Shape: Rectangular; Case/Package: 0402; Terminal Finish: Nickel; Min Operating Temperature: -55°C; Max Operating Temperature: 155°C; Tolerance: 5%; JESD-609 Code: e3; Resistor Type: FIXED RESISTOR; Construction: Chip; Package Style: SMTMeter; Packaging: Tape and Reel; Technology: METAL GLAZE/THICK FILM; Termination: Wraparound; Working Voltage: 50V; Reach SVHC Compliant: Yes; RoHS Compliant: Yes; ComponentLink1URL: https://datasheet.ciiva.com:443/pdfs/VipMasterIC/IC/VISH/VISH-S-A0007266705/VISH-S-A0007266705-1.pdf?src-supplier=IHS+Markit; ComponentLink1Description: https://datasheet.ciiva.com:443/pdfs/VipMasterIC/IC/VISH/VISH-S-A0007266705/VISH-S-A0007266705-1.pdf?src-supplier=IHS+Markit; ComponentLink2URL: https://datasheet.ciiva.com/2462/dcrcwe3-2462082.pdf?src-supplier=Digikey; ComponentLink2Description: https://datasheet.ciiva.com/2462/dcrcwe3-2462082.pdf?src-supplier=Digikey; ComponentLink3URL: https://datasheet.ciiva.com/2462/dcrcwe3-2462083.pdf?src-supplier=Digikey; ComponentLink3Description: https://datasheet.ciiva.com/2462/dcrcwe3-2462083.pdf?src-supplier=Digikey; ComponentLink4URL: https://datasheet.ciiva.com/2462/dcrcwe3-2462084.pdf?src-supplier=Digikey; ComponentLink4Description: https://datasheet.ciiva.com/2462/dcrcwe3-2462084.pdf?src-supplier=Digikey; ComponentLink5URL: https://datasheet.ciiva.com/3256/dcrcwe3-3256245.pdf?src-supplier=Avnet; ComponentLink5Description: https://datasheet.ciiva.com/3256/dcrcwe3-3256245.pdf?src-supplier=Avnet; ComponentLink6URL: https://datasheet.ciiva.com/16776/70201119-16776940.pdf?src-supplier=Allied+Electronics; ComponentLink6Description: https://datasheet.ciiva.com/16776/70201119-16776940.pdf?src-supplier=Allied+Electronics; ComponentLink7URL: https://datasheet.ciiva.com/22872/70201119-22872138.pdf?src-supplier=Allied+Electronics; ComponentLink7Description: https://datasheet.ciiva.com/22872/70201119-22872138.pdf?src-supplier=Allied+Electronics; Supplier 1: Mouser; Supplier Part Number 1: 71-CRCW0402J-22K-E3
R14 = 1M_0402_Resistor: Fixed Resistor, Metal Glaze/thick Film, 0.063W, 1000000ohm, 50V, 1% +/-Tol, 100ppm/Cel, Surface Mount, 0402, CRCW04021M00FKED; Manufacturer: Vishay; Power: 63mW; Value: 1MR; Temperature Coefficient: 100ppm/°C; Rated Temperature: 70°C; Package Height: 0.35mm; Package Length: 1mm; Package Width: 0.5mm; Reference Standard: AEC-Q200; Supplier: Digikey; Supplier Part Number: 541-1.00MLCT-ND; Manufacturer Part Number: CRCW04021M00FKED; RoHS: Yes; Category: Chip SMD Resistors; Stock: 378165; Pricing: 1=0.1, 10=0.026, 50=0.0164, 100=0.0137, 500=0.00934, 1000=0.00806, 5000=0.00591 (USD); Mounting Technology: Surface Mount; Pins: 2; Package Shape: Rectangular; Case/Package: 0402; Terminal Finish: Nickel; Min Operating Temperature: -55°C; Max Operating Temperature: 155°C; Tolerance: 1%; JESD-609 Code: e3; Resistor Type: FIXED RESISTOR; Construction: Chip; Package Style: SMTMeter; Packaging: Tape and Reel; Technology: METAL GLAZE/THICK FILM; Working Voltage: 50V; Termination: Wraparound; Reach SVHC Compliant: Yes; RoHS Compliant: Yes; ComponentLink1URL: https://datasheet.ciiva.com:443/pdfs/VipMasterIC/IC/VISH/VISH-S-A0007266705/VISH-S-A0007266705-1.pdf?src-supplier=IHS+Markit; ComponentLink1Description: https://datasheet.ciiva.com:443/pdfs/VipMasterIC/IC/VISH/VISH-S-A0007266705/VISH-S-A0007266705-1.pdf?src-supplier=IHS+Markit; ComponentLink2URL: https://datasheet.ciiva.com/11809/0900766b80d98824-11809936.pdf?src-supplier=Rs; ComponentLink2Description: https://datasheet.ciiva.com/11809/0900766b80d98824-11809936.pdf?src-supplier=Rs; ComponentLink3URL: https://datasheet.ciiva.com/7841/1697337-7841486.pdf?src-supplier=Element14; ComponentLink3Description: https://datasheet.ciiva.com/7841/1697337-7841486.pdf?src-supplier=Element14; ComponentLink4URL: https://datasheet.ciiva.com/7841/1697337-7841806.pdf?src-supplier=Element14; ComponentLink4Description: https://datasheet.ciiva.com/7841/1697337-7841806.pdf?src-supplier=Element14; ComponentLink5URL: https://datasheet.ciiva.com/26316/fld-crcw-e3-data-en-26316602.pdf?src-supplier=Distrelec; ComponentLink5Description: https://datasheet.ciiva.com/26316/fld-crcw-e3-data-en-26316602.pdf?src-supplier=Distrelec; ComponentLink6URL: https://datasheet.ciiva.com/2463/dcrcwe3-2463361.pdf?src-supplier=Digikey; ComponentLink6Description: https://datasheet.ciiva.com/2463/dcrcwe3-2463361.pdf?src-supplier=Digikey; ComponentLink7URL: https://datasheet.ciiva.com/2463/dcrcwe3-2463362.pdf?src-supplier=Digikey; ComponentLink7Description: https://datasheet.ciiva.com/2463/dcrcwe3-2463362.pdf?src-supplier=Digikey; ComponentLink8URL: https://datasheet.ciiva.com/2463/dcrcwe3-2463363.pdf?src-supplier=Digikey; ComponentLink8Description: https://datasheet.ciiva.com/2463/dcrcwe3-2463363.pdf?src-supplier=Digikey; ComponentLink9URL: https://datasheet.ciiva.com/3256/dcrcwe3-3256185.pdf?src-supplier=Avnet; ComponentLink9Description: https://datasheet.ciiva.com/3256/dcrcwe3-3256185.pdf?src-supplier=Avnet; ComponentLink10URL: https://datasheet.ciiva.com/3256/dcrcwe3-3256184.pdf?src-supplier=Avnet; ComponentLink10Description: https://datasheet.ciiva.com/3256/dcrcwe3-3256184.pdf?src-supplier=Avnet; ComponentLink11URL: https://datasheet.ciiva.com/5548/dcrcwe3-109170-5548277.pdf?src-supplier=Mouser; ComponentLink11Description: https://datasheet.ciiva.com/5548/dcrcwe3-109170-5548277.pdf?src-supplier=Mouser; ComponentLink12URL: https://datasheet.ciiva.com/16211/dcrcwe3-16211596.pdf?src-supplier=Future+Electronics; ComponentLink12Description: https://datasheet.ciiva.com/16211/dcrcwe3-16211596.pdf?src-supplier=Future+Electronics; Supplier 1: Digikey; Supplier Part Number 1: 541-1.00MLCT-ND
R15 R16 = 10k_0603_Resistor: Fixed Resistor, Thin Film, 0.1W, 10000ohm, 75V, 0.1% +/-Tol, 25ppm/Cel, Surface Mount, 0603, RT0603BRD1010KL; Manufacturer: Yageo; Manufacturer Series: RT; Power: 100mW; Rated Temperature: 70°C; Value: 10kR; Temperature Coefficient: 25ppm/°C; Package Height: 0.45mm; Package Length: 1.6mm; Package Width: 0.8mm; Supplier: Digikey; Supplier Part Number: YAG5992CT-ND; Manufacturer Part Number: RT0603BRD1010KL; RoHS: Yes; Category: Chip SMD Resistors; Stock: 71276; Pricing: 1=0.14, 10=0.104, 50=0.0822, 100=0.0737, 500=0.05612, 1000=0.04959, 5000=0.03675 (USD); Mounting Technology: Surface Mount; Pins: 2; Package Shape: Rectangular; Case/Package: 0603; Terminal Finish: Nickel; Min Operating Temperature: -55°C; Max Operating Temperature: 155°C; Tolerance: 0.1%; JESD-609 Code: e3; Resistor Type: FIXED RESISTOR; Construction: Chip; Package Style: SMTMeter; Packaging: Tape and Reel; Series: RT; Technology: THIN FILM; Termination: Wraparound; Working Voltage: 75V; Reach SVHC Compliant: Yes; RoHS Compliant: Yes; ComponentLink1URL: https://datasheet.ciiva.com:443/pdfs/VipMasterIC/IC/YAGO/YAGO-S-A0008510989/YAGO-S-A0008510989-1.pdf?src-supplier=IHS+Markit; ComponentLink1Description: https://datasheet.ciiva.com:443/pdfs/VipMasterIC/IC/YAGO/YAGO-S-A0008510989/YAGO-S-A0008510989-1.pdf?src-supplier=IHS+Markit; ComponentLink2URL: https://www.yageo.com/upload/media/product/productsearch/datasheet/rchip/PYu-RT_1-to-0.01_RoHS_L_12.pdf?src-supplier=Digikey; ComponentLink2Description: https://www.yageo.com/upload/media/product/productsearch/datasheet/rchip/PYu-RT_1-to-0.01_RoHS_L_12.pdf?src-supplier=Digikey; ComponentLink3URL: https://datasheet.octopart.com/RT0603BRD1010KL-Yageo-datasheet-169971040.pdf?src-supplier=Future+Electronics; ComponentLink3Description: https://datasheet.octopart.com/RT0603BRD1010KL-Yageo-datasheet-169971040.pdf?src-supplier=Future+Electronics; Supplier 1: Digikey; Supplier Part Number 1: YAG5992CT-ND
U3 = nRF_Transceiver: Telecom IC, PQCC20, NRF24L01P-T; Manufacturer: Nordic Semiconductor; Package Body Material: Plastic; Nominal Supply Voltage: 3V; Qualification Status: Not Qualified; Supplier: Digikey; Supplier Part Number: 4823-NRF24L01P-T-ND; Manufacturer Part Number: NRF24L01P-T; RoHS: Yes; Category: RF Receivers, Transceivers; Stock: 12641; Pricing: 1=2.16, 100=1.86, 500=1.8 (USD); Case/Package: QCCN; Pins: 20; Package Shape: Square; Min Operating Temperature: -40°C; Max Operating Temperature: 85°C; Package Style: CHIP CARRIERMeter; Surface Mount: Yes; Terminal Form: No Lead; Terminal Position: QUAD; Power Supplies: 3V; Terminal Pitch: 0.5mm; Temperature Grade: INDUSTRIAL; Reach SVHC Compliant: Yes; RoHS Compliant: Yes; ComponentLink1URL: https://datasheet.ciiva.com:443/pdfs/VipMasterIC/IC/NRSA/NRSAS00057/NRSAS00057-1.pdf?src-supplier=IHS+Markit; ComponentLink1Description: https://datasheet.ciiva.com:443/pdfs/VipMasterIC/IC/NRSA/NRSAS00057/NRSAS00057-1.pdf?src-supplier=IHS+Markit; ComponentLink2URL: https://www.distrelec.biz/Web/Downloads/2_/en/nordic-nrf24l01p_tds.pdf?mime=application%2Fpdf&src-supplier=Distrelec; ComponentLink2Description: https://www.distrelec.biz/Web/Downloads/2_/en/nordic-nrf24l01p_tds.pdf?mime=application%2Fpdf&src-supplier=Distrelec; ComponentLink3URL: http://www.mouser.com/ds/2/297/nRF24L01P-224815.pdf?src-supplier=Mouser; ComponentLink3Description: http://www.mouser.com/ds/2/297/nRF24L01P-224815.pdf?src-supplier=Mouser; ComponentLink4URL: http://www.nordicsemi.com/eng/content/download/2726/34069/file/nRF24L01P_Product_Specification_1_0.pdf?src-supplier=Digikey; ComponentLink4Description: http://www.nordicsemi.com/eng/content/download/2726/34069/file/nRF24L01P_Product_Specification_1_0.pdf?src-supplier=Digikey; ComponentLink5URL: http://www.nordicsemi.com/eng/content/download/2726/34069/file/nRF24L01P_Product_Specification_1_0.pdf?src-supplier=Avnet; ComponentLink5Description: http://www.nordicsemi.com/eng/content/download/2726/34069/file/nRF24L01P_Product_Specification_1_0.pdf?src-supplier=Avnet; ComponentLink6URL: https://www.verical.com/server-webapp/html/getDatasheet?partID=368176&src-supplier=Verical; ComponentLink6Description: https://www.verical.com/server-webapp/html/getDatasheet?partID=368176&src-supplier=Verical; Supplier 1: Digikey; Supplier Part Number 1: 4823-NRF24L01P-T-ND
U4 = IMU: Accelerometer, LSM6DSR; Manufacturer: STMicroelectronics; Manufacturer Part Number: LSM6DSRTR; Supplier: Digikey; Supplier Part Number: 497-19479-1-ND; RoHS: Yes; Category: Inertial Measurement Units (IMUs); Stock: 14511; Pricing: 1=5.91, 10=4.431, 25=3.9392, 50=3.742, 100=3.6436, 500=3.05272, 1000=2.85578 (USD); RoHS Compliant: Yes; ComponentLink1URL: https://datasheet.ciiva.com:443/pdfs/VipMasterIC/IC/SGST/SGST-S-A0008001389/SGST-S-A0008001389-1.pdf?src-supplier=IHS+Markit; ComponentLink1Description: https://datasheet.ciiva.com:443/pdfs/VipMasterIC/IC/SGST/SGST-S-A0008001389/SGST-S-A0008001389-1.pdf?src-supplier=IHS+Markit; ComponentLink2URL: https://www.st.com/resource/en/datasheet/lsm6dsr.pdf?src-supplier=Digikey; ComponentLink2Description: https://www.st.com/resource/en/datasheet/lsm6dsr.pdf?src-supplier=Digikey; Supplier 1: Digikey; Supplier Part Number 1: 497-19479-1-ND
Y3 = 16MHz_Oscillator: Crystal 16MHz ±20ppm (Tol) ±30ppm (Stability) 18pF FUND 50Ohm 2-Pin Mini-CSMD T/R, ABM7-16.000MHZ-D2Y-T Abracon; Supplier: Avnet; Supplier Part Number: ABM7-16.000MHZ-D2Y; Manufacturer: Abracon; Manufacturer Part Number: ABM7-16.000MHZ-D2Y-T; RoHS: Yes; Category: Crystals; Stock: 54000; Pricing: 1000=0.385, 2000=0.3775, 4000=0.37, 6000=0.35525, 8000=0.3479, 10000=0.3336, 100000=0.2992 (USD); ComponentLink1URL: https://datasheet.ciiva.com/5788/abm7-5788054.pdf?src-supplier=Farnell; ComponentLink1Description: https://datasheet.ciiva.com/5788/abm7-5788054.pdf?src-supplier=Farnell; Supplier 1: Digikey; Supplier Part Number 1: 535-9840-1-ND